# Altium schematic sheet 0 revision history.SchDoc
size A4; DocumentNumber: 0; SheetNumber: 1; SheetTotal: 12
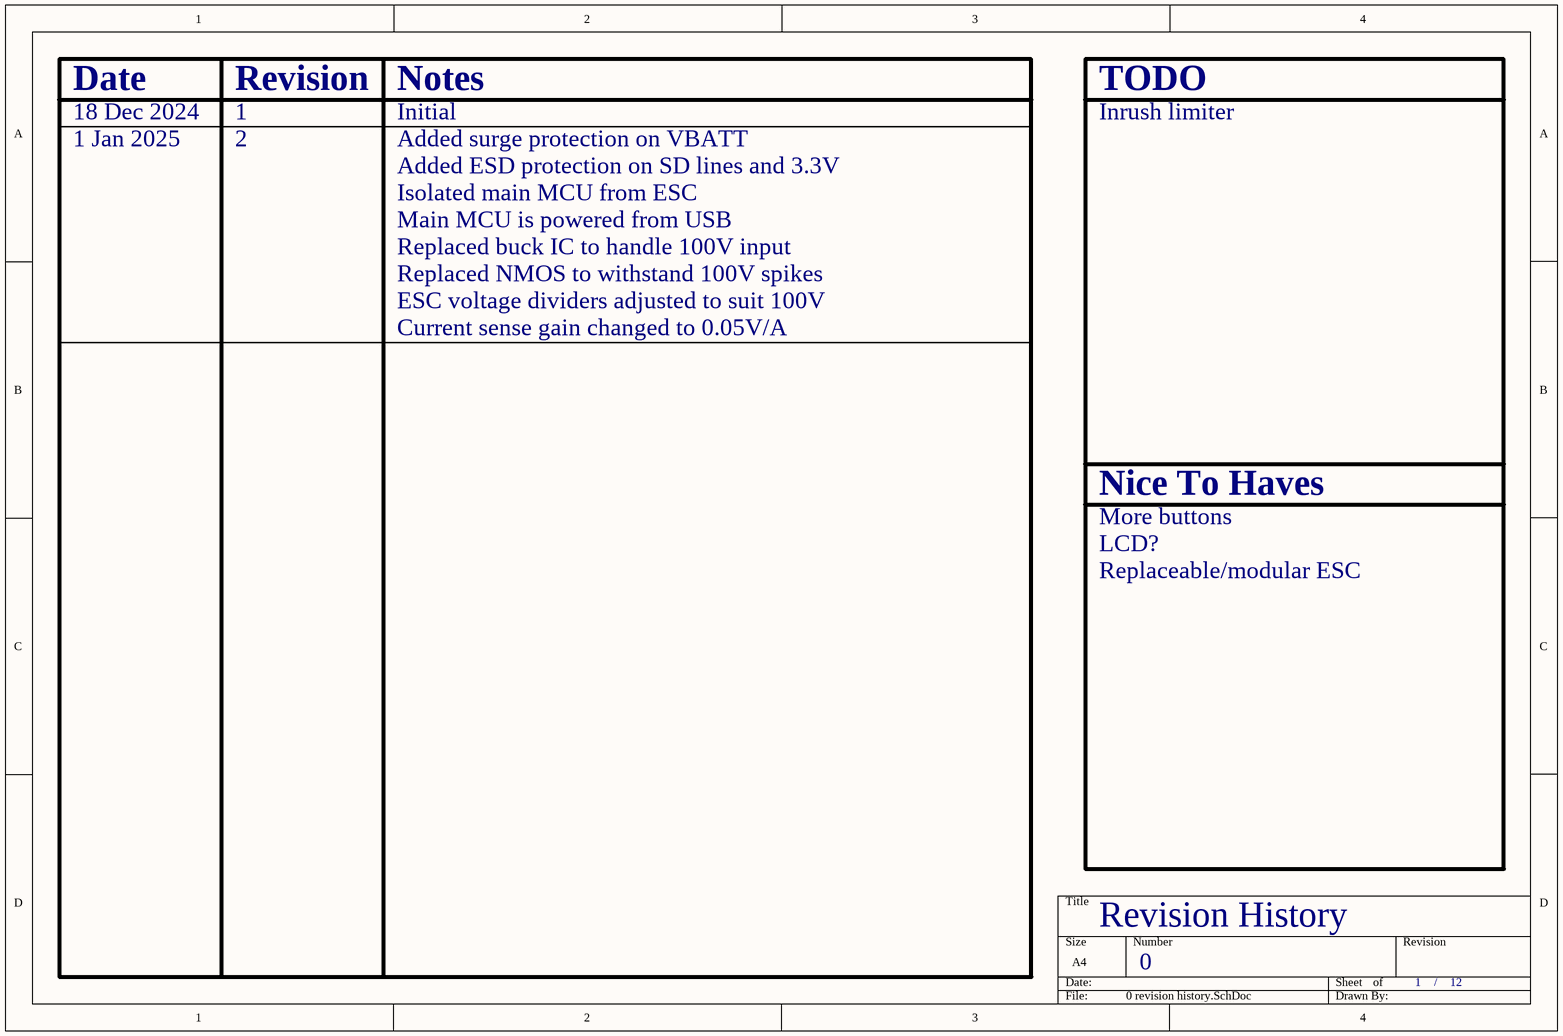
[diagram p0: 0 revision history.SchDoc]

## Notes on the sheet
- Date
- Revision
- Notes
- TODO
- 18 Dec 2024
- 1 Jan 2025
- 1
- 2
- Initial
- Added surge protection on VBATT
- Added ESD protection on SD lines and 3.3V
- Inrush limiter
- Isolated main MCU from ESC
- Main MCU is powered from USB
- Replaced buck IC to handle 100V input
- Replaced NMOS to withstand 100V spikes
- ESC voltage dividers adjusted to suit 100V
- Current sense gain changed to 0.05V/A
- Nice To Haves
- Replaceable/modular ESC
- More buttons
- LCD?
- Revision History
- /